# EAGLE design PWR_1_0 (EAGLE 8.3.2)
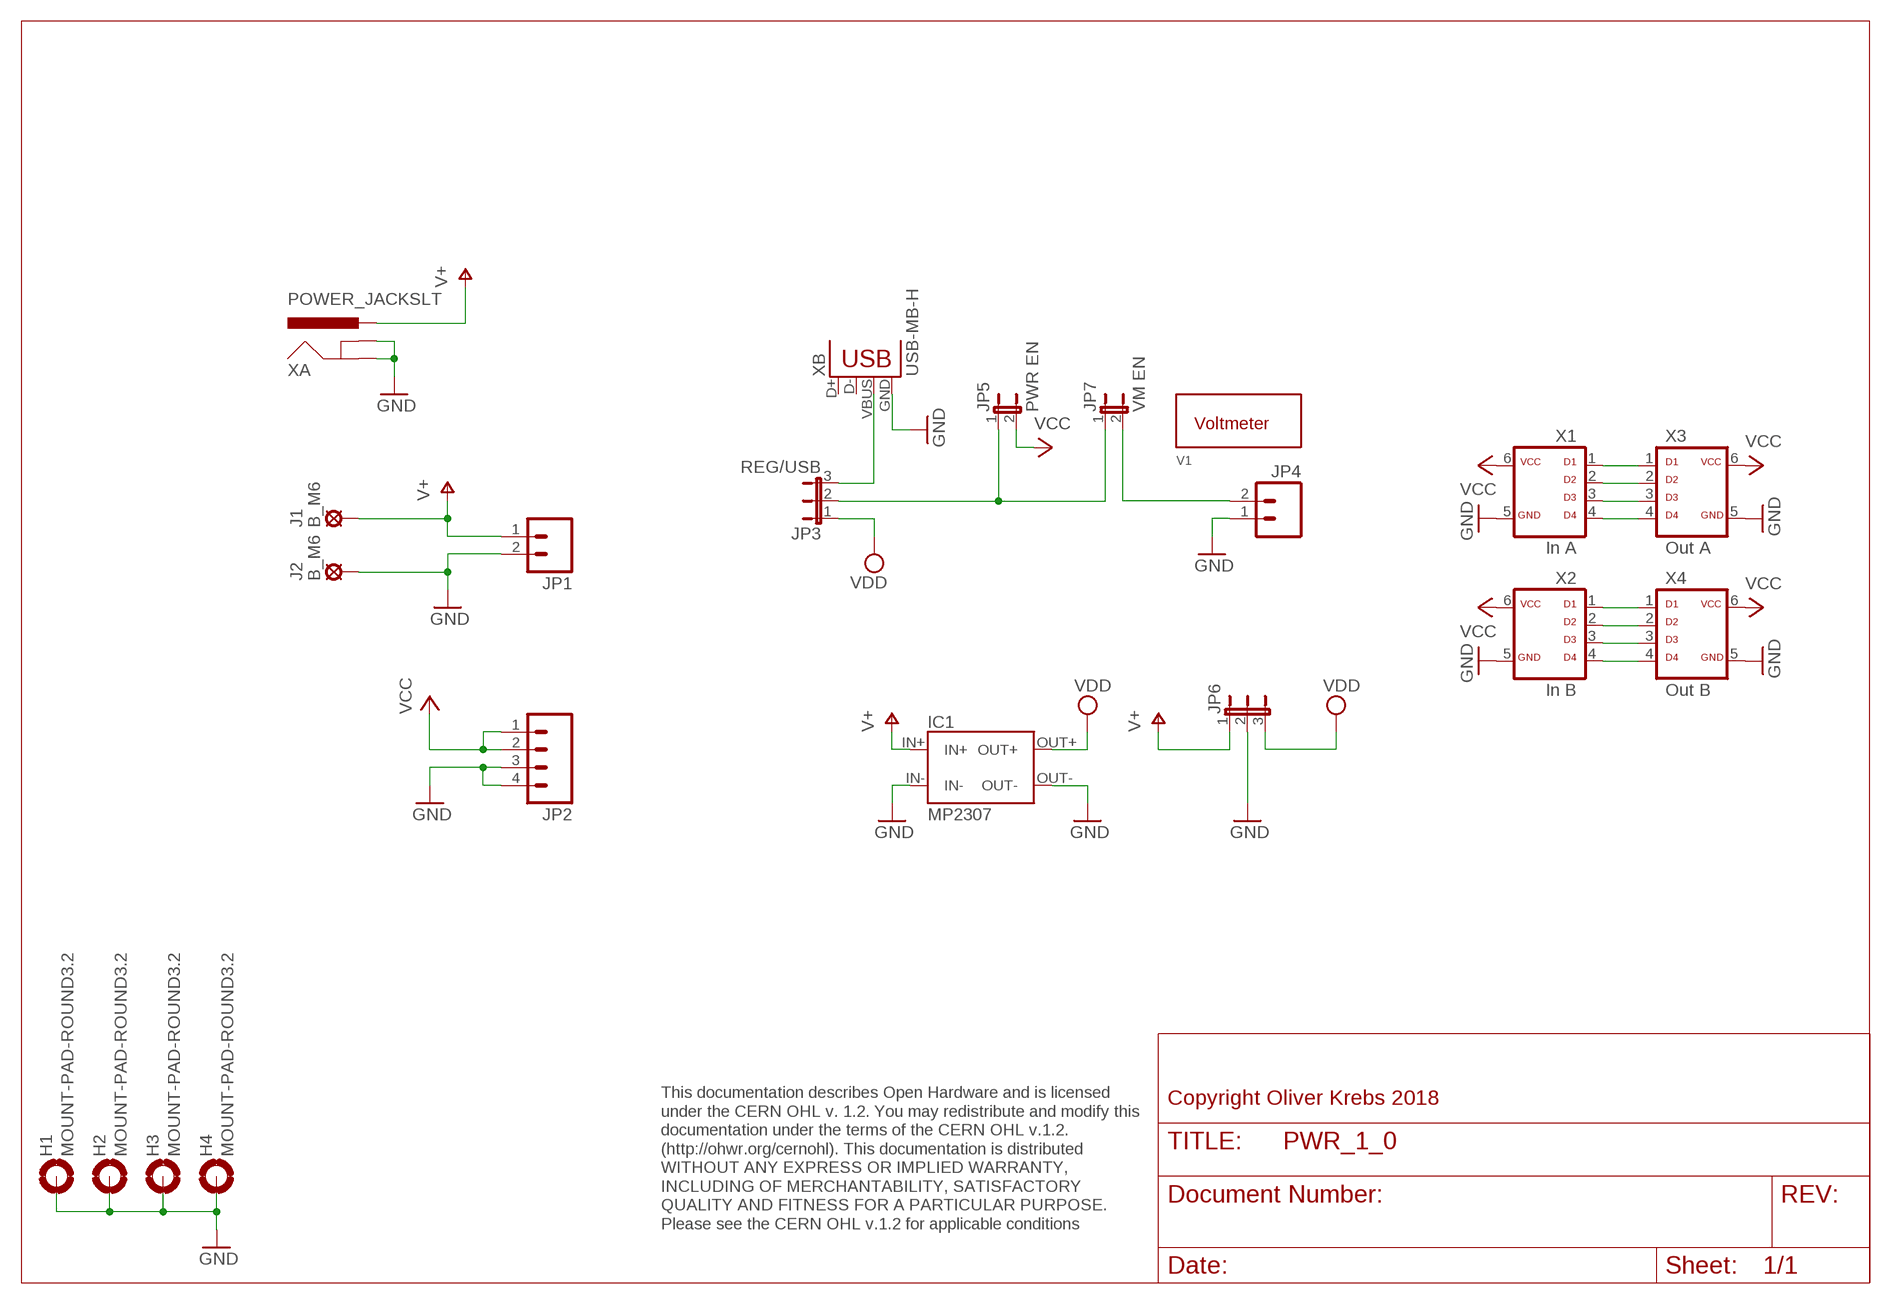
[diagram p0: schematic, sheet 1]

## Parts
H1  MOUNT-PAD-ROUND3.2  [3,2-PAD]
H2  MOUNT-PAD-ROUND3.2  [3,2-PAD]
H3  MOUNT-PAD-ROUND3.2  [3,2-PAD]
H4  MOUNT-PAD-ROUND3.2  [3,2-PAD]
IC1  MP2307  [MP2307]
J1  B_M6  [BANANA_M6]
J2  B_M6  [BANANA_M6]
JP1  M021.3MM-5.08  [1X02_BIG_5.08]
JP2  M04PTH  [1X04]
JP3  REG/USB  JP2EJP2-U  [JP2-U]
JP4  M02PTH  [1X02]
JP5  PWR EN  JP1E  [JP1]
JP6  JP2EJP2-U  [JP2-U]
JP7  VM EN  JP1E  [JP1]
V1  VOLTMETER-28  [VOLTMETER-28]
X1  In A  ML6D  [ML-6]
X2  In B  ML6D  [ML-6]
X3  Out A  ML6D  [ML-6]
X4  Out B  ML6D  [ML-6]
XA  POWER_JACKSLT  [POWER_JACK_SLOT]
XB  USB-MB-H  [USB-MB-H]

## Nets
GND: H1.B3,2(MOUNT) H2.B3,2(MOUNT) H3.B3,2(MOUNT) H4.B3,2(MOUNT) IC1.IN- IC1.OUT- J2.1(MP) JP1.2 JP2.3 JP2.4 JP4.1 JP6.2 X1.5 X2.5 X3.5 X4.5 XA.GND@1(GNDBREAK) XA.GND@2(GND) XB.GND
N$1: X1.1 X3.1
N$2: X1.2 X3.2
N$3: X1.3 X3.3
N$4: X1.4 X3.4
N$5: X2.1 X4.1
N$6: X2.2 X4.2
N$7: X2.3 X4.3
N$8: X2.4 X4.4
N$9: JP3.2 JP5.1 JP7.1
N$10: JP3.3 XB.VBUS
N$11: JP4.2 JP7.2
V+: IC1.IN+ J1.1(MP) JP1.1 JP6.1 XA.PWR
VCC: JP2.1 JP2.2 JP5.2 X1.6 X2.6 X3.6 X4.6
VDD: IC1.OUT+ JP3.1 JP6.3
Unconnected: XB.D+ XB.D-

## Notes on the sheet
- Copyright Oliver Krebs 2018
- This documentation describes Open Hardware and is licensed 
  under the CERN OHL v. 1.2. You may redistribute and modify this 
  documentation under the terms of the CERN OHL v.1.2. 
  (http://ohwr.org/cernohl). This documentation is distributed
  WITHOUT ANY EXPRESS OR IMPLIED WARRANTY, 
  INCLUDING OF MERCHANTABILITY, SATISFACTORY 
  QUALITY AND FITNESS FOR A PARTICULAR PURPOSE. 
  Please see the CERN OHL v.1.2 for applicable conditions

## Library data of the parts
H1-H4 = holes:MOUNT-PAD-ROUND: MOUNTING PAD, round
IC1 = 01-my-con:MP2307
J1 J2 = 01-my-solpad:B_M6
JP1 JP4 = SparkFun-Connectors:M02: Standard 2-pin 0.1" header. Use with - straight break away headers ( PRT-00116) - right angle break away headers (PRT-00553) - swiss pins (PRT-00743) - machine pins (PRT-00117) - female headers (PRT-00115) Molex polarized connector foot print use with: PRT-08233 with associated crimp pins and housings. 2.54_SCREWTERM for use with PRT-10571. 3.5mm Screw Terminal footprints for PRT-08084 5mm Screw Terminal footprints for use with PRT-08432
JP2 = SparkFun-Connectors:M04: Header 4 Standard 4-pin 0.1" header. Use with straight break away headers (SKU : PRT-00116), right angle break away headers (PRT-00553), swiss pins (PRT-00743), machine pins (PRT-00117), and female headers (PRT-00115). Molex polarized connector foot print use with SKU : PRT-08231 with associated crimp pins and housings. 1MM SMD Version SKU: PRT-10208
JP3 JP6 = 01-my-jumper:JP2E: JUMPER
JP5 JP7 = 01-my-jumper:JP1E: JUMPER
V1 = 01-my-con:VOLTMETER
X1-X4 = 01-my-con:ML6D
XA = SparkFun-Connectors:POWER_JACK: Power Jack This is the standard 5.5mm barrel jack for power. The PTH is the most common, proven, reliable, footprint. The Slot footprint only works if the mill layer is transmitted to the PCB fab house so be warned. Mating wall wart : TOL-00298 (and others); PROD_ID: PRT-00119
XB = SparkFun-Connectors:USB: USB Connectors USB-B-PTH is fully proven SKU : PRT-00139/CONN-08278 USB-miniB is fully proven SKU : PRT-00587 USB-A-PCB is untested. USB-A-H is throughly reviewed, but untested. Spark Fun Electronics SKU : PRT-00437 USB-B-SMT is throughly reviewed, but untested. Needs silkscreen touching up. USB-A-S has not been used/tested USB-MB-H has not been used/tested USB-MICROB has been used. CONN-09505

## Board
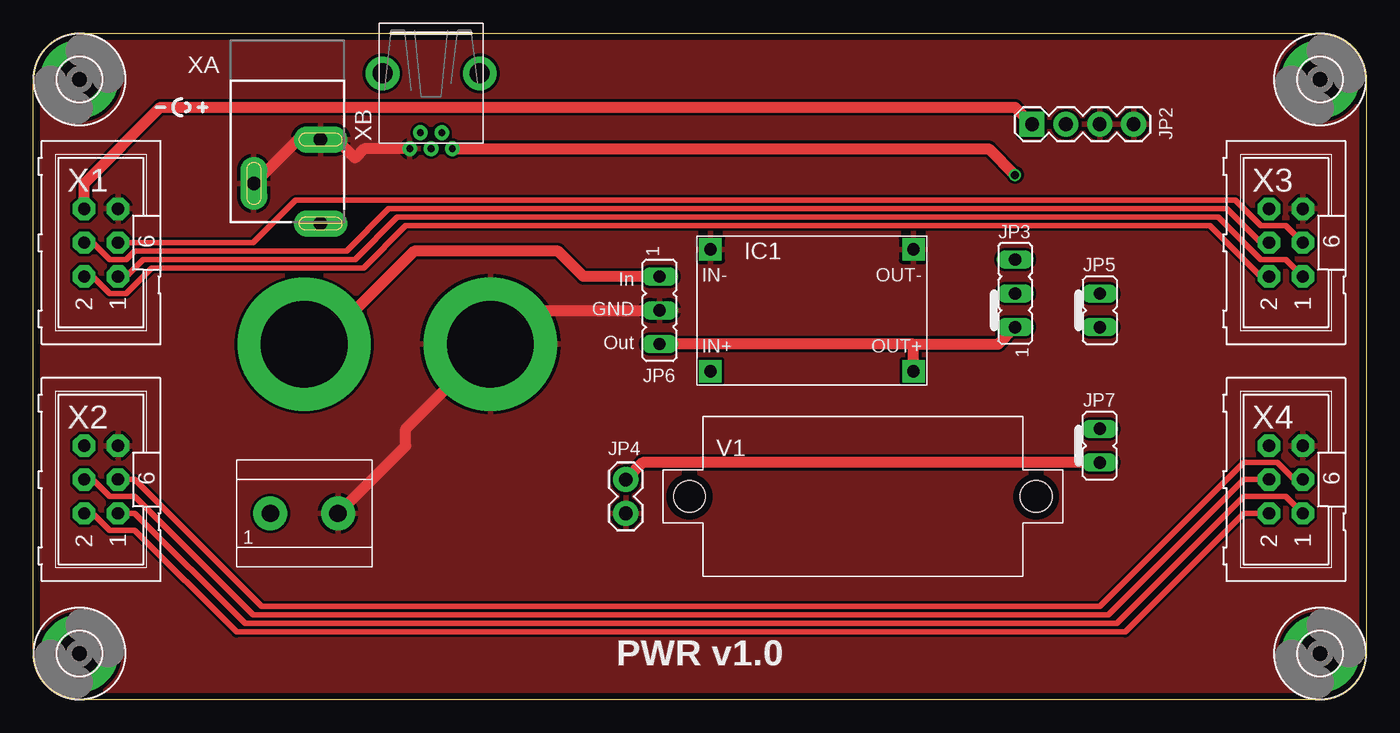
[diagram p1: board, top side]
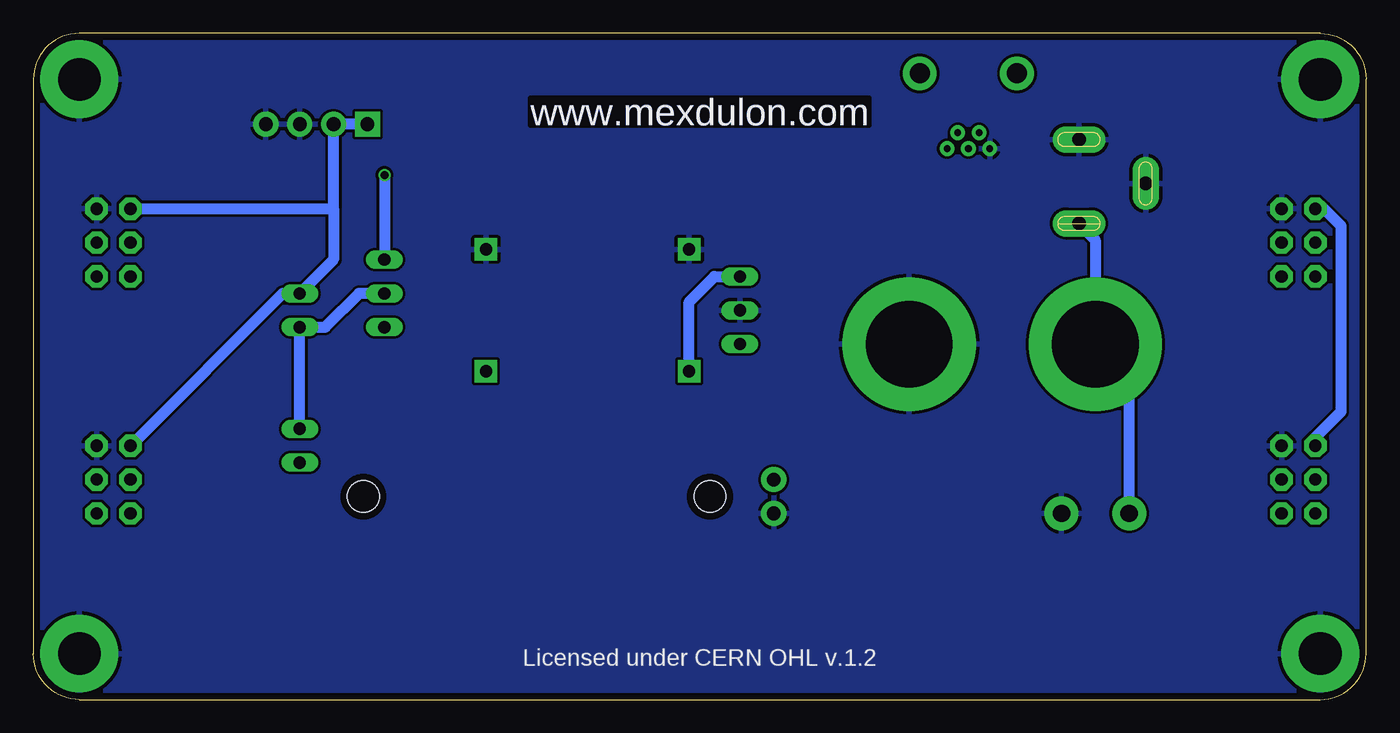
[diagram p2: board, bottom side, seen from below]

Size 100 x 50 mm. Coordinates in mm from the lower left corner, seen from the top.
Outline: 0,3.45 0,46.55 arc-90 3.45,50 96.55,50 arc-90 100,46.55 100,3.45 arc-90 96.55,0 3.45,0 arc-90 0,3.45
Copper layers (1*16): Top 0.035mm / dielectric 1.6mm / Bottom 0.035mm
Design rules "Elecrow_2-layer_PCB_eagle_rule_8mil": minimum track width 8mil, minimum drill 12mil, track to track 8mil, track to pad 8mil, pad to pad 8mil, via to via 8mil, smd to smd 0mil, copper to edge 20mil, drill to drill 10mil, minimum pad ring 6mil, minimum via ring 6mil, stop-mask expansion 0mil, vias tented up to drill 100mil, thermal gap 10mil

### Footprints (pad centres in the part's own frame; a part is rotated, then mirrored left to right if it is on the bottom)
3,2-PAD = drill 3.2 pad 5.842: B3,2 0,0
MP2307 = drill 0.914 pad 1.676 square: IN+ -7.62,-4.572; IN- -7.62,4.572; OUT+ 7.62,-4.572; OUT- 7.62,4.572
BANANA_M6 = drill 6.5 pad 10: 1 0,0
1X02_BIG_5.08 = drill 1.3 pad 2.54: 1 -2.54,0; 2 2.54,0
1X04 = drill 1.016 pad 1.88 square: 1 0,0 | drill 1.016 pad 1.88: 2 2.54,0; 3 5.08,0; 4 7.62,0
JP2-U = drill 0.914 long: 1 -2.54,0; 2 0,0; 3 2.54,0
1X02 = drill 1.016 pad 1.88: 1 0,0; 2 2.54,0
JP1 = drill 0.914 long: 1 0,-1.27; 2 0,1.27
VOLTMETER-28 = hole 2.4: -13,0; 13,0
ML-6 = drill 0.914 pad 1.676 octagon: 1 -2.54,-1.27; 2 -2.54,1.27; 3 0,-1.27; 4 0,1.27; 5 2.54,-1.27; 6 2.54,1.27
POWER_JACK_SLOT = drill 1 pad 2 long: GND@1 2.58,7.5; GND@2 7.58,10.8; PWR 2.58,13.8
USB-MB-H = drill 0.5 pad 1.1: D+ 5.65,0; D- 4.45,0.8; GND 5.65,-1.6; ID 4.45,-0.8; VBUS 5.65,1.6 | drill 1.5 pad 2.54: P$6 0,-3.65; P$7 0,3.65

### Placement (x,y rotation side)
H1  3.45,3.45 0 top
H2  3.45,46.55 0 top
H3  96.55,46.55 0 top
H4  96.55,3.45 0 top
IC1  58.42,29.21 0 top
J1  20.32,26.67 0 top
J2  34.29,26.67 0 top
JP1  20.32,13.97 0 top
JP2  74.93,43.18 0 top
JP3  73.66,30.48 90 top
JP4  44.45,13.97 90 top
JP5  80.01,29.21 0 top
JP6  46.99,29.21 270 top
JP7  80.01,19.05 180 top
V1  62.23,15.24 0 top
X1  5.08,34.29 90 top
X2  5.08,16.51 90 top
X3  93.98,34.29 90 top
X4  93.98,16.51 90 top
XA  24.13,49.53 180 top
XB  29.84,46.99 270 top

### Tracks (layer width: path | path; a pad name or v marks a point on that pad's centre or on a via)
GND
  Top 0.813: JP6.2 36.83,29.21 J2.1 27.94,20.32 27.94,19.05 JP1.2 | XB.GND 24.83,41.34 24.13,40.64 22.74,42.03 XA.GND@1 19.85,42.03 XA.GND@2
  pour Bottom (isolate 0.203): 0,50.16 100.33,50.16 100.33,0 0,0
  pour Top (isolate 0.203): 0,50.16 100.33,50.16 100.33,0 0,0
N$1
  Top 0.406: X1.1 6.99,31.75 8.26,33.02 24.13,33.02 27.3,36.2 88.9,36.2 92.08,33.02 93.98,33.02 X3.1
N$2
  Top 0.406: X3.2 92.08,31.75 88.27,35.56 27.94,35.56 24.77,32.38 8.89,32.38 6.99,30.48 5.71,30.48 4.45,31.75 X1.2
N$3
  Top 0.406: X1.3 16.51,34.29 19.68,37.47 90.17,37.47 92.08,35.56 93.98,35.56 X3.3
N$4
  Top 0.406: X3.4 92.08,34.29 89.53,36.83 26.67,36.83 23.5,33.66 7.62,33.66 6.99,33.02 5.71,33.02 4.45,34.29 X1.4
N$5
  Top 0.406: X2.1 7.62,13.97 15.88,5.71 81.28,5.71 90.81,15.24 93.98,15.24 X4.1
N$6
  Top 0.406: X4.2 90.81,13.97 81.92,5.08 15.24,5.08 7.62,12.7 5.71,12.7 4.45,13.97 X2.2
N$7
  Top 0.406: X2.3 7.62,16.51 17.14,6.99 80.01,6.99 90.81,17.78 93.34,17.78 94.61,16.51 X4.3
N$8
  Top 0.406: X4.4 90.81,16.51 80.64,6.35 16.51,6.35 7.62,15.24 5.71,15.24 4.45,16.51 X2.4
N$9
  Bottom 0.813: JP3.2 75.56,30.48 78.11,27.94 JP5.1 JP7.1
N$10  (via drill 0.6)
  Top 0.813: XB.VBUS 71.69,41.34 v73.66,39.37
  Bottom 0.813: v73.66,39.37 JP3.3
N$11
  Top 0.813: JP7.2 45.72,17.78 JP4.2
V+
  Top 0.813: JP6.1 41.27,31.75 39.37,33.66 28.57,33.66 21.59,26.67 J1.1
  Bottom 0.813: 21.72,35.56 XA.PWR 20.32,34.5 J1.1 17.78,24.13 JP1.1 | IC1.IN+ 50.8,29.84 48.9,31.75 JP6.1
VCC
  Top 0.813: X1.6 3.81,38.73 9.53,44.45 73.66,44.45 JP2.1
  Bottom 0.813: JP2.1 JP2.2 77.47,36.83 | X2.6 3.81,19.68 1.91,21.59 1.91,35.56 3.17,36.83 X1.6 | 77.47,36.83 77.47,33.02 JP5.2 81.28,30.48 X4.6 | X3.6 77.47,36.83
VDD
  Top 0.813: 66.04,26.67 JP6.3 | 66.04,26.67 72.39,26.67 JP3.1 | IC1.OUT+ 66.04,26.67

### Text on the board
Bottom: www.mexdulon.com
tPlace: In | GND | Out | PWR v1.0
bNames: www.mexdulon.com | Licensed under CERN OHL v.1.2
tValues: VCC | GND | VCC | PWR | PWR | V+ | GND | VM | + | - | V+ | GND | Power Regulation and Voltmeter
200bmp: E:/Bilder/Elektronik/Modulion/Mexdulon/mexdulon_50x50_pcb.bmp